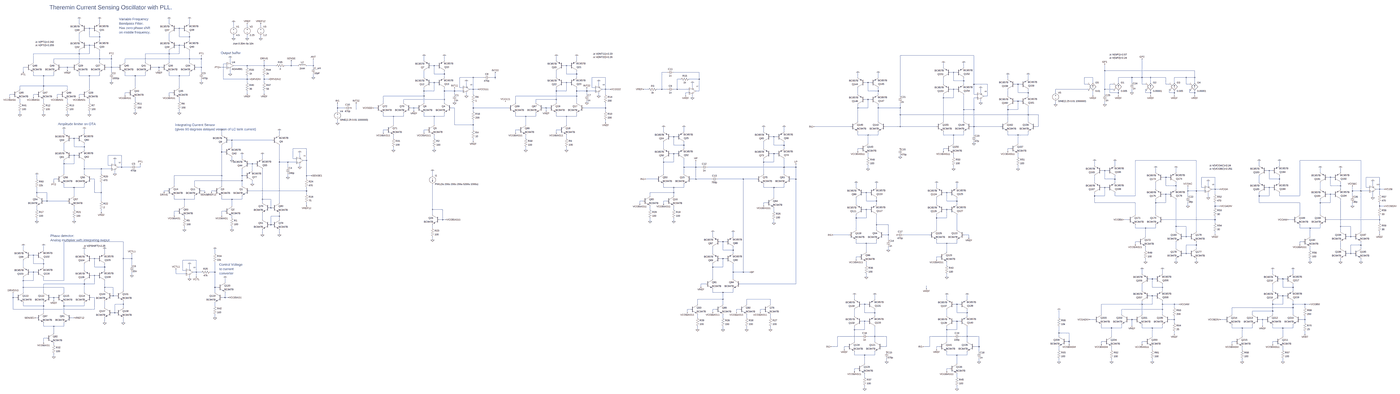
[diagram p0: schematic vco_and_lc_drive_v06.asc, whole sheet]
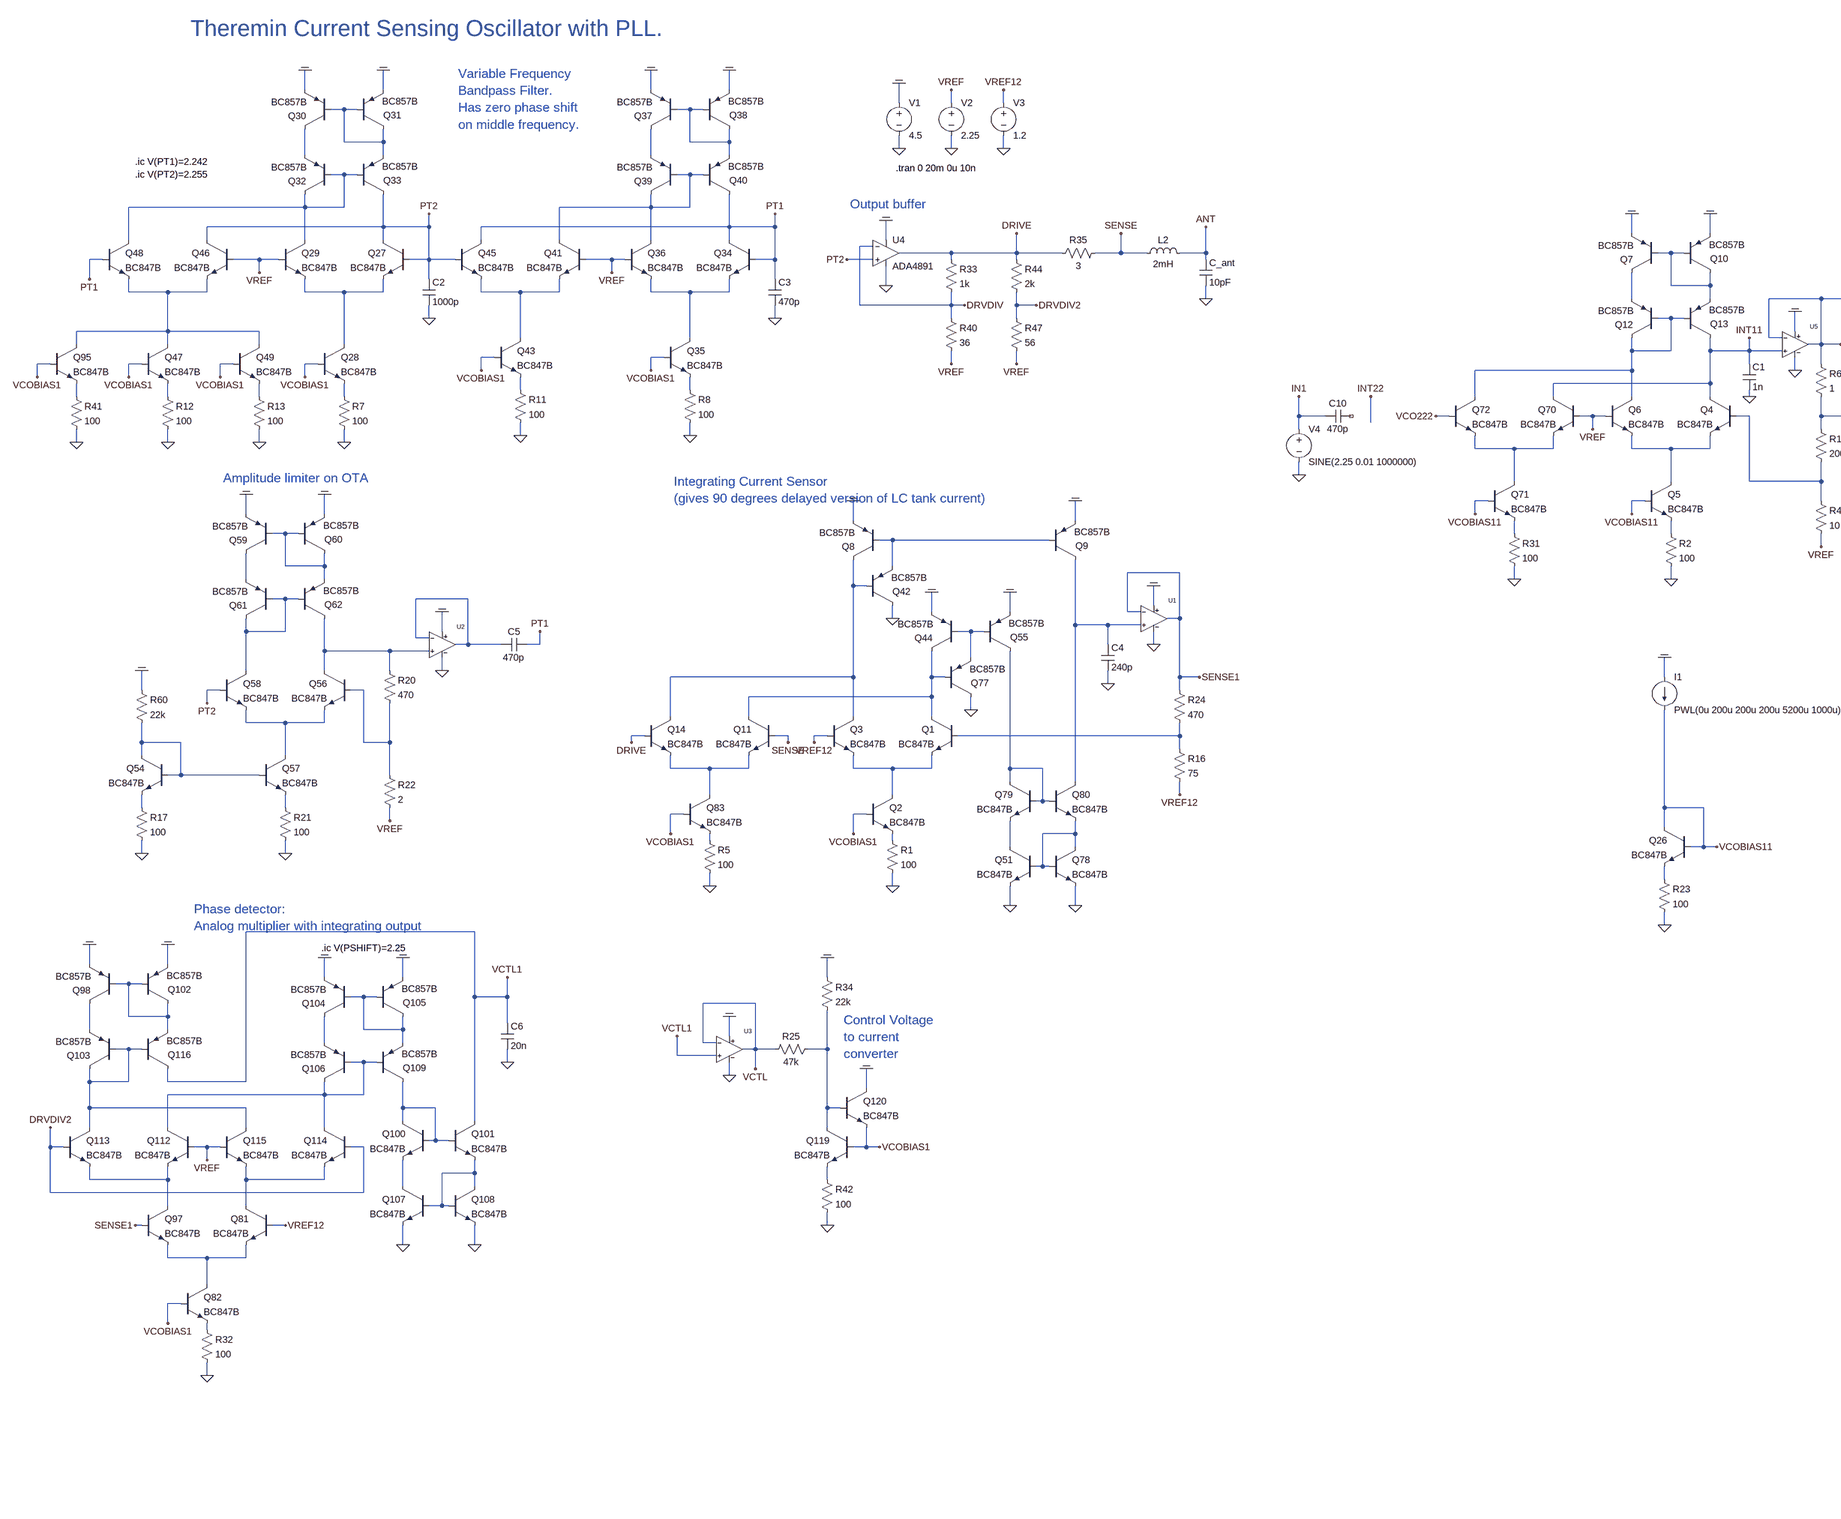
[diagram p1: schematic vco_and_lc_drive_v06.asc, part, row 1 of 1, column 1 of 3]
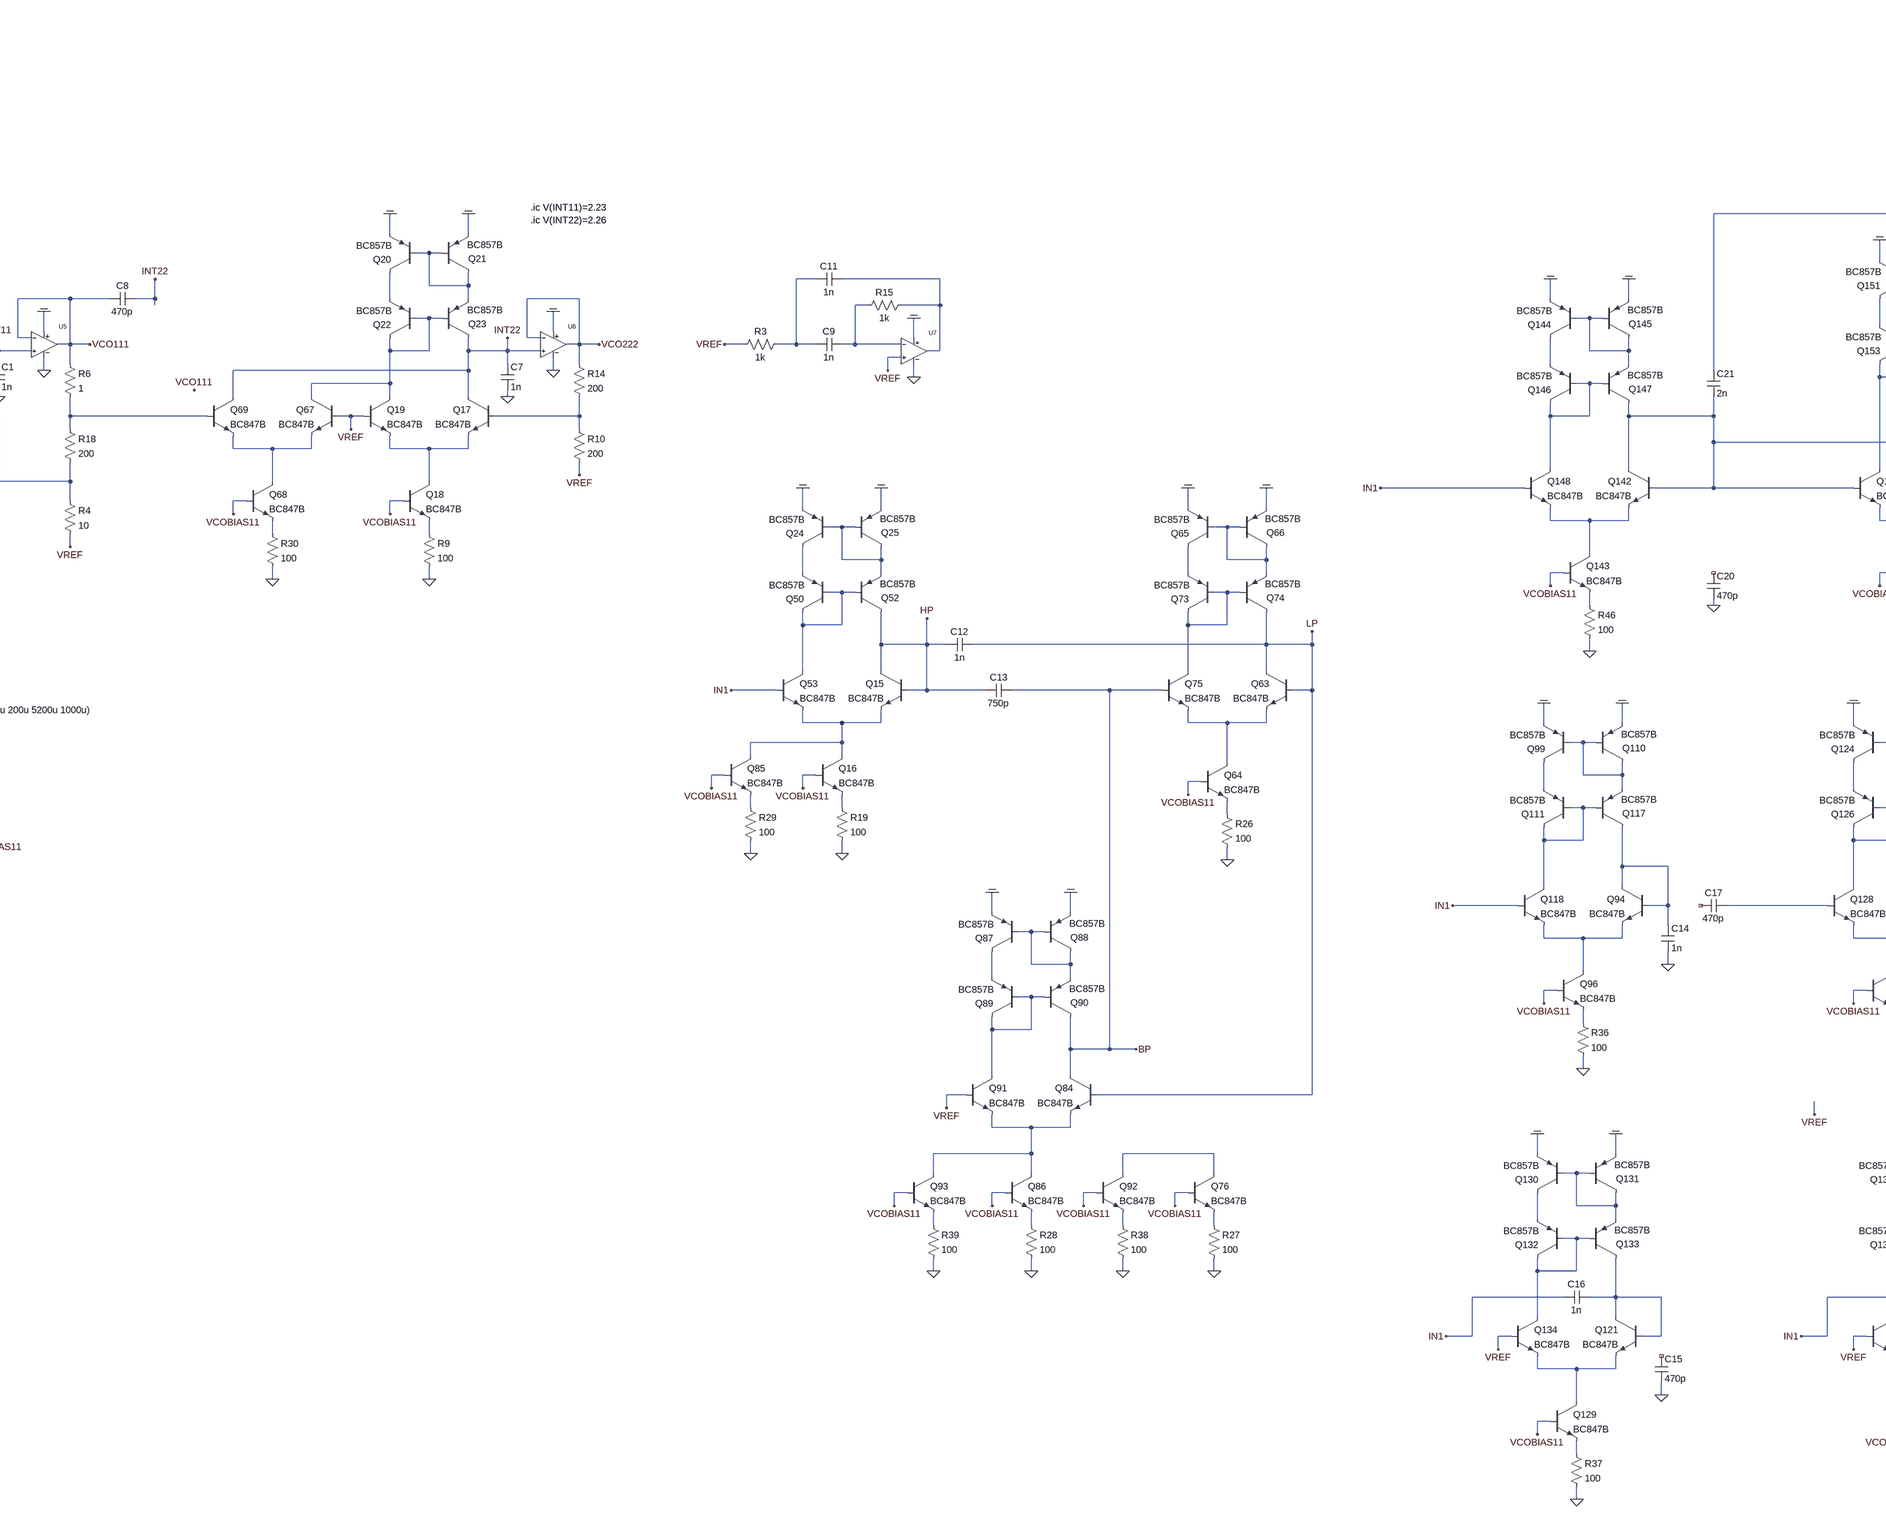
[diagram p2: schematic vco_and_lc_drive_v06.asc, part, row 1 of 1, column 2 of 3]
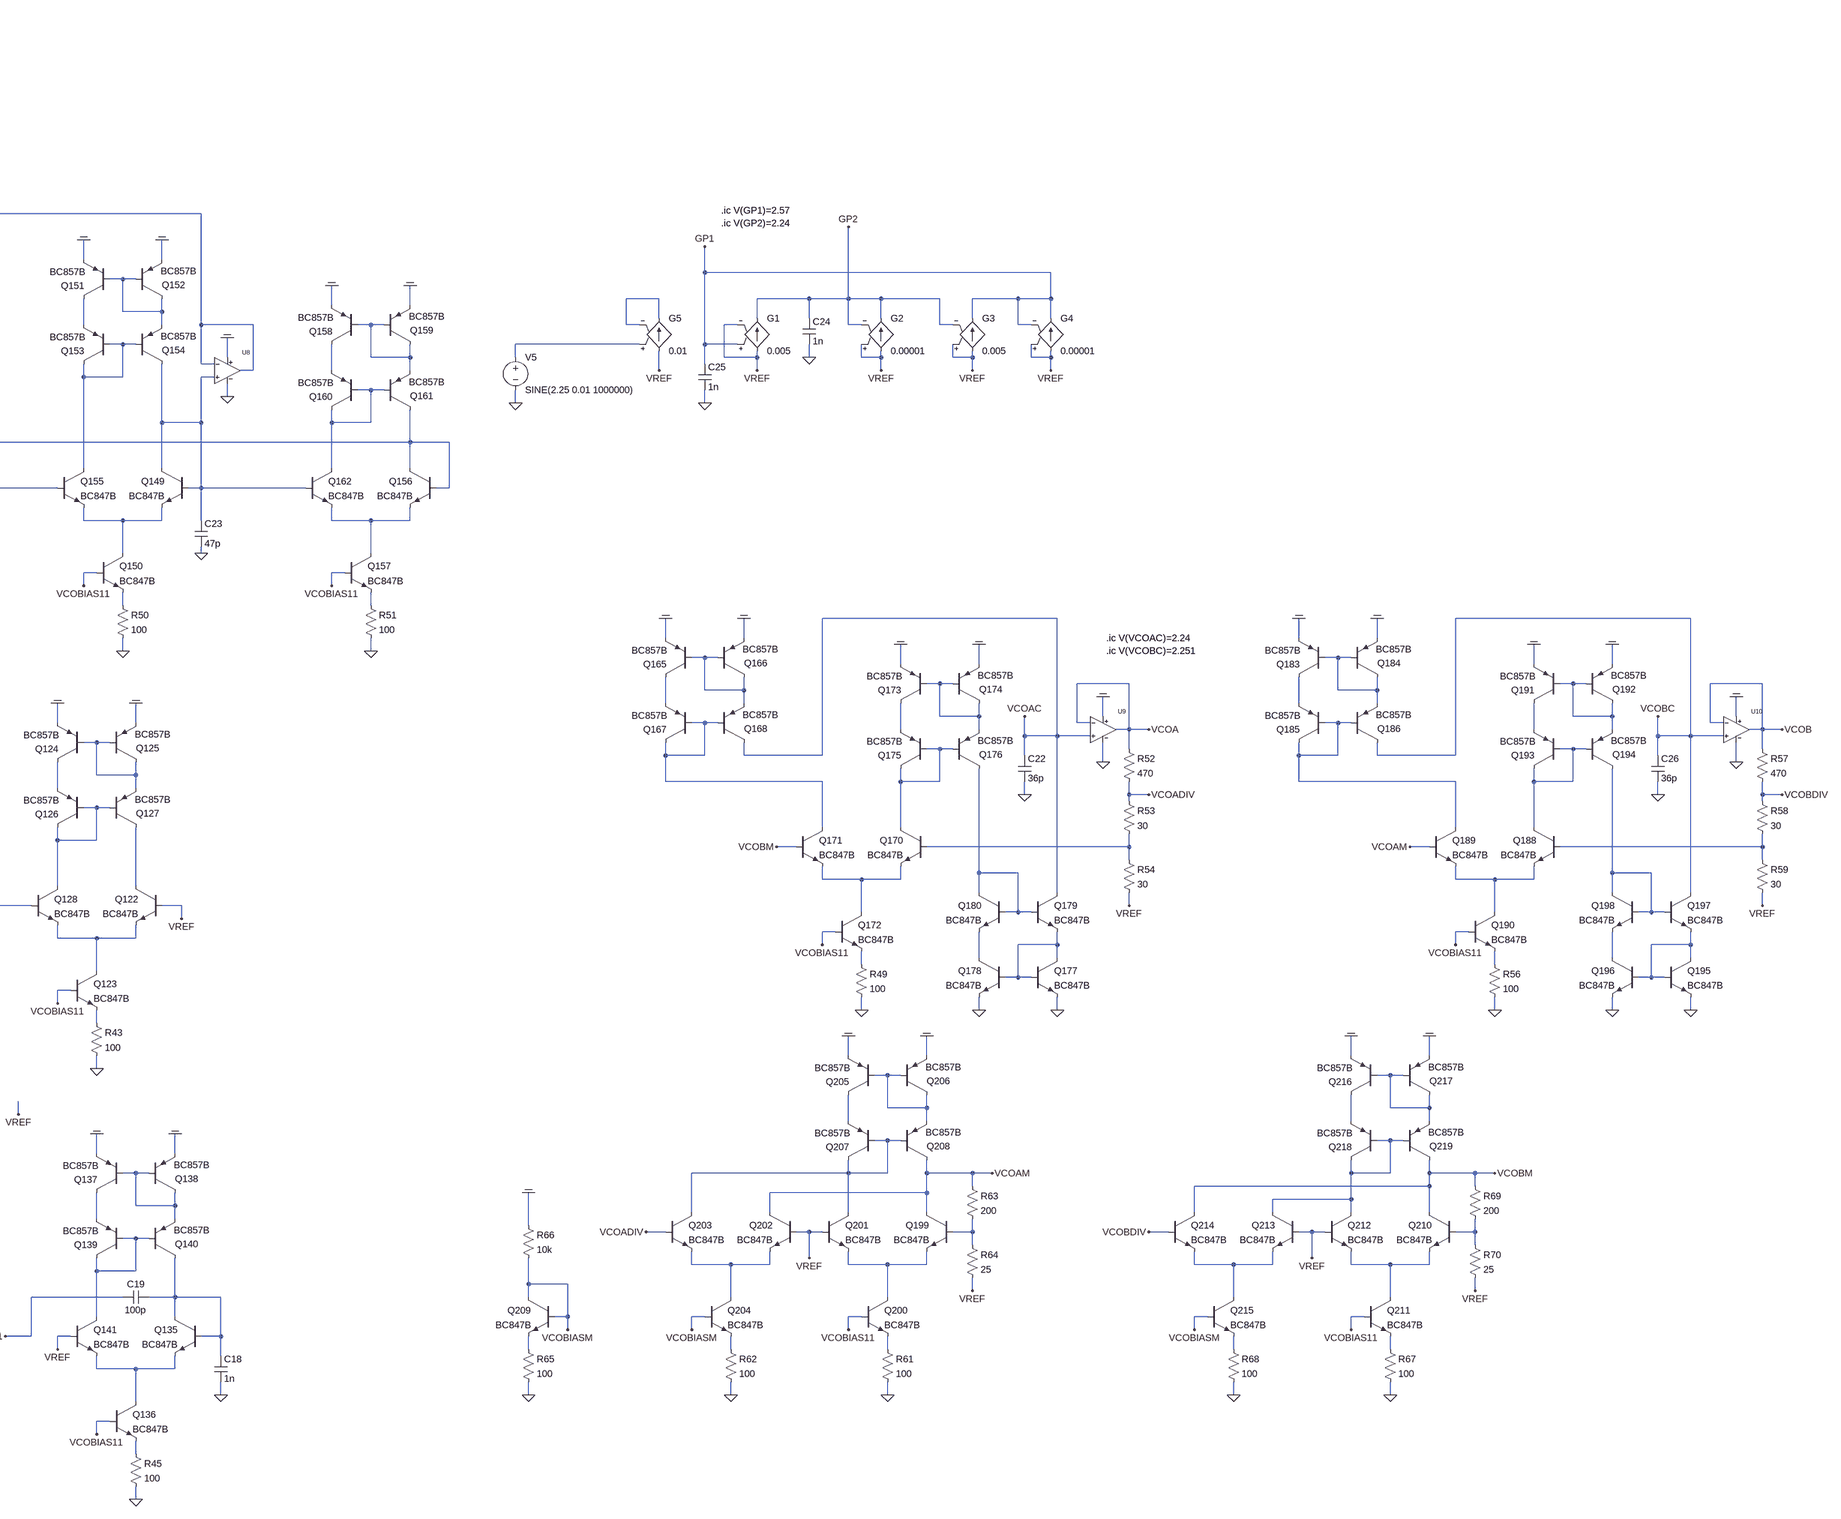
[diagram p3: schematic vco_and_lc_drive_v06.asc, part, row 1 of 1, column 3 of 3]
* vco_and_lc_drive_v06.asc
V1 COM 0 4.5
V2 VREF 0 2.25
R60 COM N088 22k
Q54 N088 N088 N098 0 BC847B
R17 N098 0 100
Q27 PT2 PT2 N014 0 BC847B
Q28 N014 VCOBIAS1 N038 0 BC847B
Q29 N005 VREF N014 0 BC847B
R7 N038 0 100
Q30 N003 N001 COM 0 BC857B
Q31 N001 N001 COM 0 BC857B
Q32 N005 N005 N003 0 BC857B
Q33 PT2 N005 N001 0 BC857B
Q34 PT1 PT1 N016 0 BC847B
Q35 N016 VCOBIAS1 N033 0 BC847B
Q36 N006 VREF N016 0 BC847B
R8 N033 0 100
Q37 N004 N002 COM 0 BC857B
Q38 N002 N002 COM 0 BC857B
Q39 N006 N006 N004 0 BC857B
Q40 PT1 N006 N002 0 BC857B
C2 PT2 0 1000p
C5 PT1 N065 470p
Q41 N006 VREF N015 0 BC847B
Q43 N015 VCOBIAS1 N032 0 BC847B
Q45 PT1 PT2 N015 0 BC847B
R11 N032 0 100
Q46 PT2 VREF N013 0 BC847B
Q47 N013 VCOBIAS1 N036 0 BC847B
Q48 N005 PT1 N013 0 BC847B
R12 N036 0 100
Q56 N071 N077 N080 0 BC847B
Q57 N080 N088 N099 0 BC847B
Q58 N064 PT2 N080 0 BC847B
R20 N071 N077 470
R21 N099 0 100
R22 N077 VREF 2
Q59 N060 N052 COM 0 BC857B
Q60 N052 N052 COM 0 BC857B
Q61 N064 N064 N060 0 BC857B
Q62 N071 N064 N052 0 BC857B
XU2 N071 N065 COM 0 N065 MCP6021  ; pins In+ In- V+ V- OUT
R33 DRIVE DRVDIV 1k
L2 SENSE ANT 2mH Rser=120 Cpar=1pF
C_ant ANT 0 10pF
R35 DRIVE SENSE 3
V3 VREF12 0 1.2
Q1 N074 N087 N094 0 BC847B
Q2 N094 VCOBIAS1 N107 0 BC847B
R1 N107 0 100
Q3 N061 VREF12 N094 0 BC847B
Q8 N061 N057 COM 0 BC857B
Q9 N069 N057 COM 0 BC857B
Q11 N074 SENSE N093 0 BC847B
Q14 N061 DRIVE N093 0 BC847B
Q42 0 N061 N057 0 BC857B
Q44 N074 N070 COM 0 BC857B
Q55 N095 N070 COM 0 BC857B
Q77 0 N074 N070 0 BC857B
Q83 N093 VCOBIAS1 N106 0 BC847B
R5 N106 0 100
R16 N087 VREF12 75
R24 SENSE1 N087 470
R40 DRVDIV VREF 36
C3 PT1 0 470p
Q49 N013 VCOBIAS1 N037 0 BC847B
R13 N037 0 100
Q95 N013 VCOBIAS1 N035 0 BC847B
R41 N035 0 100
R44 DRIVE DRVDIV2 2k
R47 DRVDIV2 VREF 56
C4 N069 0 240p
Q81 N152 VREF12 N165 0 BC847B
Q82 N165 VCOBIAS1 N172 0 BC847B
R32 N172 0 100
Q97 N151 SENSE1 N165 0 BC847B
Q107 N154 N148 0 0 BC847B
Q108 N148 N148 0 0 BC847B
C6 VCTL1 0 20n
Q112 N138 VREF N151 0 BC847B
Q113 N136 DRVDIV2 N151 0 BC847B
Q114 N138 DRVDIV2 N152 0 BC847B
Q115 N136 VREF N152 0 BC847B
Q100 N141 N141 N154 0 BC847B
Q101 VCTL1 N141 N148 0 BC847B
Q104 N135 N130 COM 0 BC857B
Q105 N130 N130 COM 0 BC857B
Q106 N138 N138 N135 0 BC857B
Q109 N141 N138 N130 0 BC857B
Q98 N134 N129 COM 0 BC857B
Q102 N129 N129 COM 0 BC857B
Q103 N136 N136 N134 0 BC857B
Q116 VCTL1 N136 N129 0 BC857B
XU3 VCTL1 VCTL COM 0 VCTL MCP6021  ; pins In+ In- V+ V- OUT
Q51 N108 N105 0 0 BC847B
Q78 N105 N105 0 0 BC847B
Q79 N095 N095 N108 0 BC847B
Q80 N069 N095 N105 0 BC847B
R25 N137 VCTL 47k
R34 COM N137 22k
Q119 N137 VCOBIAS1 N153 0 BC847B
Q120 COM N137 VCOBIAS1 0 BC847B
R42 N153 0 100
XU1 N069 SENSE1 COM 0 SENSE1 MCP6021  ; pins In+ In- V+ V- OUT
XU4 PT2 DRVDIV COM 0 DRIVE ADA4891-1  ; pins In+ In- V+ V- OUT
Q4 INT11 N039 N044 0 BC847B
Q5 N044 VCOBIAS11 N054 0 BC847B
Q6 N021 VREF N044 0 BC847B
R2 N054 0 100
Q7 N017 N008 COM 0 BC857B
Q10 N008 N008 COM 0 BC857B
Q12 N021 N021 N017 0 BC857B
Q13 INT11 N021 N008 0 BC857B
C1 INT11 0 1n
R4 N039 VREF 10
R6 VCO111 N040 1
V4 IN1 0 SINE(2.25 0.01 1000000)
Q26 VCOBIAS11 VCOBIAS11 N114 0 BC847B
R23 N114 0 100
XU5 INT11 VCO111 COM 0 VCO111 MCP6021  ; pins In+ In- V+ V- OUT
Q17 INT22 N041 N046 0 BC847B
Q18 N046 VCOBIAS11 N056 0 BC847B
Q19 N022 VREF N046 0 BC847B
R9 N056 0 100
Q20 N018 N009 COM 0 BC857B
Q21 N009 N009 COM 0 BC857B
Q22 N022 N022 N018 0 BC857B
Q23 INT22 N022 N009 0 BC857B
C7 INT22 0 1n
R10 N041 VREF 200
R14 VCO222 N041 200
XU6 INT22 VCO222 COM 0 VCO222 MCP6021  ; pins In+ In- V+ V- OUT
Q67 N022 VREF N045 0 BC847B
Q68 N045 VCOBIAS11 N055 0 BC847B
Q69 INT22 N040 N045 0 BC847B
R30 N055 0 100
Q70 INT11 VREF N043 0 BC847B
Q71 N043 VCOBIAS11 N053 0 BC847B
Q72 N021 VCO222 N043 0 BC847B
R31 N053 0 100
I1 COM VCOBIAS11 PWL(0u 200u 200u 200u 5200u 1000u)
R18 N040 N039 200
C10 NC_01 IN1 470p
C8 INT22 VCO111 470p
R3 N010 VREF 1k
C9 N020 N010 1n
C11 N011 N010 1n
R15 N011 N020 1k
XU7 VREF N020 COM 0 N011 MCP6021  ; pins In+ In- V+ V- OUT
Q15 HP HP N081 0 BC847B
Q16 N081 VCOBIAS11 N101 0 BC847B
R19 N101 0 100
Q24 N058 N050 COM 0 BC857B
Q25 N050 N050 COM 0 BC857B
Q50 N062 N062 N058 0 BC857B
Q52 HP N062 N050 0 BC857B
Q53 N062 IN1 N081 0 BC847B
C12 LP HP 1n
C13 BP HP 750p
Q63 LP LP N082 0 BC847B
Q64 N082 VCOBIAS11 N104 0 BC847B
R26 N104 0 100
Q65 N059 N051 COM 0 BC857B
Q66 N051 N051 COM 0 BC857B
Q73 N063 N063 N059 0 BC857B
Q74 LP N063 N051 0 BC857B
Q75 N063 BP N082 0 BC847B
Q84 BP LP N144 0 BC847B
Q86 N144 VCOBIAS11 N158 0 BC847B
R28 N158 0 100
Q87 N128 N119 COM 0 BC857B
Q88 N119 N119 COM 0 BC857B
Q89 N131 N131 N128 0 BC857B
Q90 BP N131 N119 0 BC857B
Q91 N131 VREF N144 0 BC847B
Q92 N147 VCOBIAS11 N159 0 BC847B
R38 N159 0 100
Q93 N144 VCOBIAS11 N157 0 BC847B
R39 N157 0 100
Q76 N147 VCOBIAS11 N160 0 BC847B
R27 N160 0 100
Q85 N081 VCOBIAS11 N100 0 BC847B
R29 N100 0 100
Q94 N111 N111 N120 0 BC847B
Q96 N120 VCOBIAS11 N132 0 BC847B
R36 N132 0 100
Q99 N096 N089 COM 0 BC857B
Q110 N089 N089 COM 0 BC857B
Q111 N102 N102 N096 0 BC857B
Q117 N111 N102 N089 0 BC857B
Q118 N102 IN1 N120 0 BC847B
C14 N111 0 1n
Q122 N117 VREF N121 0 BC847B
Q123 N121 VCOBIAS11 N133 0 BC847B
R43 N133 0 100
Q124 N097 N090 COM 0 BC857B
Q125 N090 N090 COM 0 BC857B
Q126 N103 N103 N097 0 BC857B
Q127 N117 N103 N090 0 BC857B
Q128 N103 N118 N121 0 BC847B
C17 N118 NC_02 470p
Q121 N170 N170 N178 0 BC847B
Q129 N178 VCOBIAS11 N180 0 BC847B
R37 N180 0 100
Q130 N155 N149 COM 0 BC857B
Q131 N149 N149 COM 0 BC857B
Q132 N163 N163 N155 0 BC857B
Q133 N170 N163 N149 0 BC857B
Q134 N163 VREF N178 0 BC847B
C15 NC_03 0 470p
C16 N170 IN1 1n
Q135 N171 N171 N179 0 BC847B
Q136 N179 VCOBIAS11 N181 0 BC847B
R45 N181 0 100
Q137 N156 N150 COM 0 BC857B
Q138 N150 N150 COM 0 BC857B
Q139 N164 N164 N156 0 BC857B
Q140 N171 N164 N150 0 BC857B
Q141 N164 VREF N179 0 BC847B
C18 N171 0 1n
C19 N171 IN1 100p
Q142 N042 N042 N047 0 BC847B
Q143 N047 VCOBIAS11 N066 0 BC847B
R46 N066 0 100
Q144 N028 N023 COM 0 BC857B
Q145 N023 N023 COM 0 BC857B
Q146 N031 N031 N028 0 BC857B
Q147 N042 N031 N023 0 BC857B
Q148 N031 IN1 N047 0 BC847B
C20 NC_04 0 470p
Q149 N030 N030 N048 0 BC847B
Q150 N048 VCOBIAS11 N067 0 BC847B
R50 N067 0 100
Q151 N024 N012 COM 0 BC857B
Q152 N012 N012 COM 0 BC857B
Q153 N026 N026 N024 0 BC857B
Q154 N030 N026 N012 0 BC857B
Q155 N026 N042 N048 0 BC847B
C23 N030 0 47p
Q156 N042 N042 N049 0 BC847B
Q157 N049 VCOBIAS11 N068 0 BC847B
R51 N068 0 100
Q158 N029 N025 COM 0 BC857B
Q159 N025 N025 COM 0 BC857B
Q160 N034 N034 N029 0 BC857B
Q161 N042 N034 N025 0 BC857B
Q162 N034 N030 N049 0 BC847B
C21 N007 N042 2n
XU8 N030 N007 COM 0 N007 MCP6021  ; pins In+ In- V+ V- OUT
G1 VREF GP2 GP1 VREF 0.005
Q165 N078 N072 COM 0 BC857B
Q166 N072 N072 COM 0 BC857B
Q167 N083 N083 N078 0 BC857B
Q168 VCOAC N083 N072 0 BC857B
C22 VCOAC 0 36p
C24 GP2 0 1n
G2 VREF GP2 VREF GP2 0.00001
G3 VREF GP1 VREF GP2 0.005
G4 VREF GP1 VREF GP1 0.00001
G5 VREF N019 N027 N019 0.01
V5 N027 0 SINE(2.25 0.01 1000000)
C25 GP1 0 1n
Q170 N091 N109 N115 0 BC847B
Q171 N083 VCOBM N115 0 BC847B
Q172 N115 VCOBIAS11 N126 0 BC847B
R49 N126 0 100
Q173 N085 N075 COM 0 BC857B
Q174 N075 N075 COM 0 BC857B
Q175 N091 N091 N085 0 BC857B
Q176 N112 N091 N075 0 BC857B
Q177 N122 N122 0 0 BC847B
Q178 N124 N122 0 0 BC847B
Q179 VCOAC N112 N122 0 BC847B
Q180 N112 N112 N124 0 BC847B
XU9 VCOAC VCOA COM 0 VCOA MCP6021  ; pins In+ In- V+ V- OUT
R52 VCOA VCOADIV 470
R53 VCOADIV N109 30
R54 N109 VREF 30
Q183 N079 N073 COM 0 BC857B
Q184 N073 N073 COM 0 BC857B
Q185 N084 N084 N079 0 BC857B
Q186 VCOBC N084 N073 0 BC857B
C26 VCOBC 0 36p
Q188 N092 N110 N116 0 BC847B
Q189 N084 VCOAM N116 0 BC847B
Q190 N116 VCOBIAS11 N127 0 BC847B
R56 N127 0 100
Q191 N086 N076 COM 0 BC857B
Q192 N076 N076 COM 0 BC857B
Q193 N092 N092 N086 0 BC857B
Q194 N113 N092 N076 0 BC857B
Q195 N123 N123 0 0 BC847B
Q196 N125 N123 0 0 BC847B
Q197 VCOBC N113 N123 0 BC847B
Q198 N113 N113 N125 0 BC847B
XU10 VCOBC VCOB COM 0 VCOB MCP6021  ; pins In+ In- V+ V- OUT
R57 VCOB VCOBDIV 470
R58 VCOBDIV N110 30
R59 N110 VREF 30
Q199 VCOAM N161 N167 0 BC847B
Q200 N167 VCOBIAS11 N175 0 BC847B
R61 N175 0 100
Q201 N145 VREF N167 0 BC847B
Q202 VCOAM VREF N166 0 BC847B
Q203 N145 VCOADIV N166 0 BC847B
Q204 N166 VCOBIASM N174 0 BC847B
R62 N174 0 100
Q205 N142 N139 COM 0 BC857B
Q206 N139 N139 COM 0 BC857B
Q207 N145 N145 N142 0 BC857B
Q208 VCOAM N145 N139 0 BC857B
R63 VCOAM N161 200
R64 N161 VREF 25
R65 N173 0 100
Q209 VCOBIASM VCOBIASM N173 0 BC847B
R66 COM VCOBIASM 10k
Q210 VCOBM N162 N169 0 BC847B
Q211 N169 VCOBIAS11 N177 0 BC847B
R67 N177 0 100
Q212 N146 VREF N169 0 BC847B
Q213 N146 VREF N168 0 BC847B
Q214 VCOBM VCOBDIV N168 0 BC847B
Q215 N168 VCOBIASM N176 0 BC847B
R68 N176 0 100
Q216 N143 N140 COM 0 BC857B
Q217 N140 N140 COM 0 BC857B
Q218 N146 N146 N143 0 BC857B
Q219 VCOBM N146 N140 0 BC857B
R69 VCOBM N162 200
R70 N162 VREF 25
.model NPN NPN
.model PNP PNP
.lib standard.bjt
.tran 0 20m 0u 10n
* Theremin Current Sensing Oscillator with PLL.
.ic V(PT1)=2.242
.ic V(PT2)=2.255
* Output buffer
* Amplitude limiter on OTA
* Variable Frequency
* Bandpass Filter.
* Has zero phase shift
* on middle frequency.
* Integrating Current Sensor
* (gives 90 degrees delayed version of LC tank current)
.ic V(PSHIFT)=2.25
* Phase detector:
* Analog multiplier with integrating output
* Control Voltage
* to current
* converter
.ic V(INT11)=2.23
.ic V(INT22)=2.26
.ic V(GP1)=2.57
.ic V(GP2)=2.24
.ic V(VCOAC)=2.24
.ic V(VCOBC)=2.251
.lib MCP6021.cir
.lib ADA4891-1.lib
.backanno
.end